# Altium schematic sheet Power.SchDoc
size A4; SheetNumber: 4; SheetTotal: 4
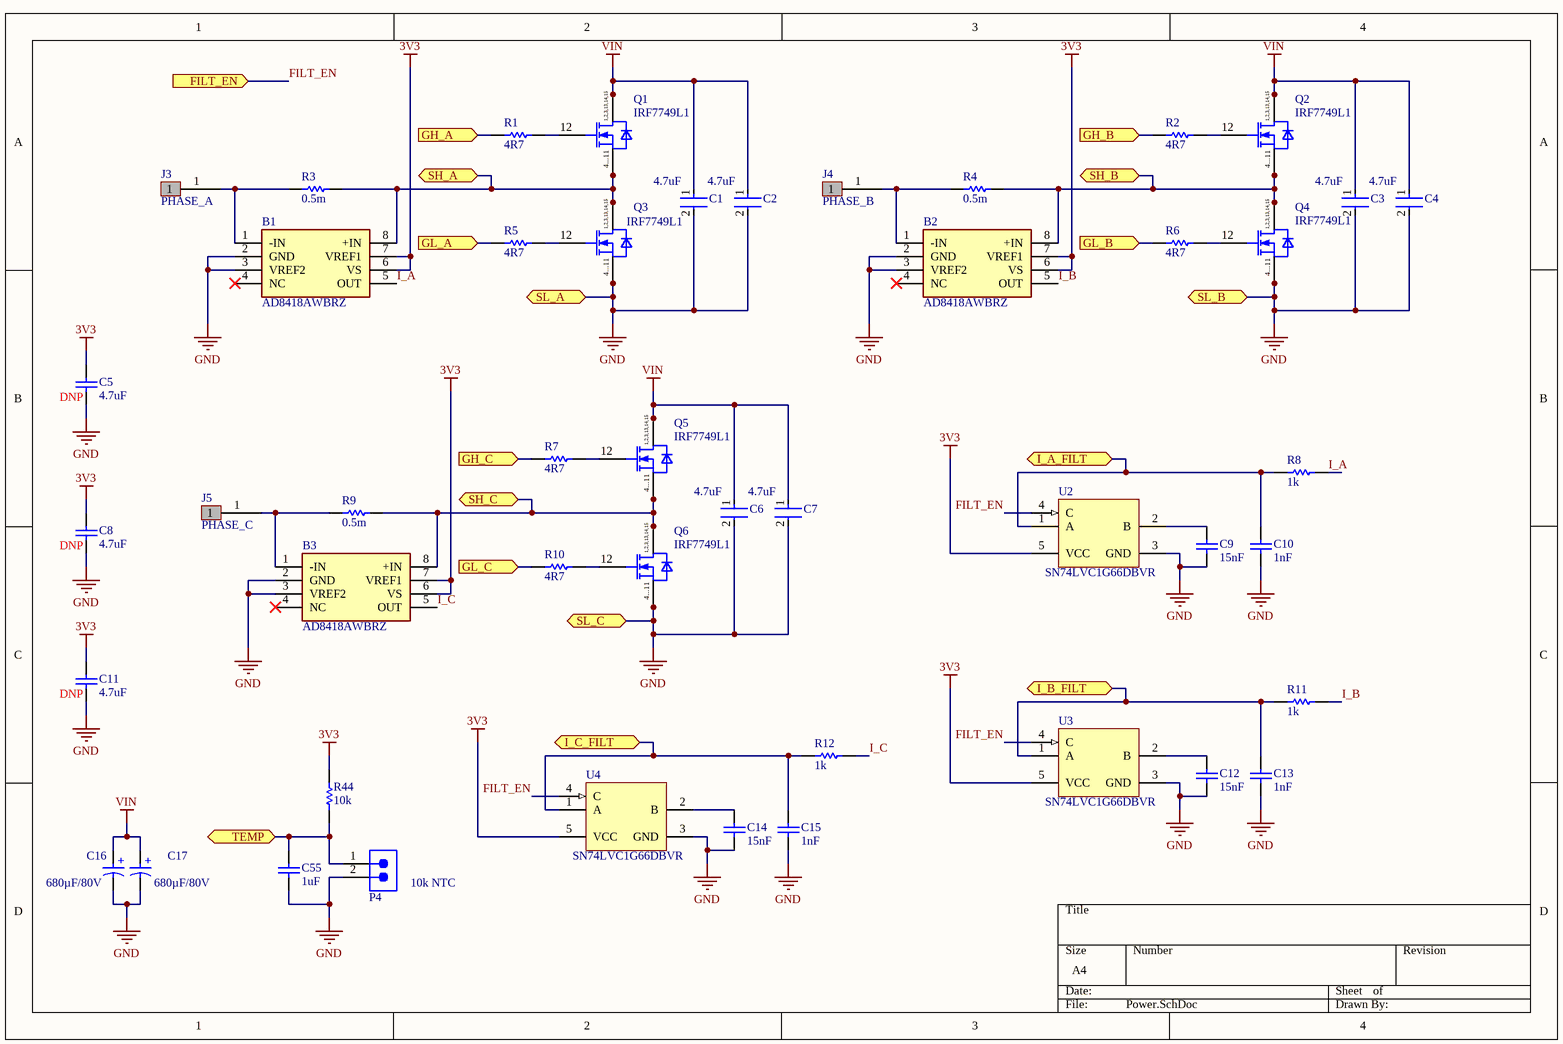
[diagram p0: Power.SchDoc]

## Parts
B1  AD8418AWBRZ  [SOP65P490X110-8N]
B2  AD8418AWBRZ  [SOP65P490X110-8N]
B3  AD8418AWBRZ  [SOP65P490X110-8N]
C1  Capacitance: 4.7uF  [FP-1210-L_3_2_0_3-W_2_5_0-IPC_A]  (hidden comment: HMK325C7475KN-TE)
C2  Capacitance: 4.7uF  [FP-1210-L_3_2_0_3-W_2_5_0-IPC_A]  (hidden comment: HMK325C7475KN-TE)
C3  Capacitance: 4.7uF  [FP-1210-L_3_2_0_3-W_2_5_0-IPC_A]  (hidden comment: HMK325C7475KN-TE)
C4  Capacitance: 4.7uF  [FP-1210-L_3_2_0_3-W_2_5_0-IPC_A]  (hidden comment: HMK325C7475KN-TE)
C5  value 4.7uF  [Wurth 0603 capacitor]  (hidden comment: Generic Capacitor 4.7uF 0603)
C6  Capacitance: 4.7uF  [FP-1210-L_3_2_0_3-W_2_5_0-IPC_A]  (hidden comment: HMK325C7475KN-TE)
C7  Capacitance: 4.7uF  [FP-1210-L_3_2_0_3-W_2_5_0-IPC_A]  (hidden comment: HMK325C7475KN-TE)
C8  value 4.7uF  [Wurth 0603 capacitor]  (hidden comment: Generic Capacitor 4.7uF 0603)
C9  value 15nF  [Wurth 0603 capacitor]  (hidden comment: Generic Capacitor 15nF 0603)
C10  value 1nF  [Wurth 0603 capacitor]  (hidden comment: Generic Capacitor 1nF 0603)
C11  value 4.7uF  [Wurth 0603 capacitor]  (hidden comment: Generic Capacitor 4.7uF 0603)
C12  value 15nF  [Wurth 0603 capacitor]  (hidden comment: Generic Capacitor 15nF 0603)
C13  value 1nF  [Wurth 0603 capacitor]  (hidden comment: Generic Capacitor 1nF 0603)
C14  value 15nF  [Wurth 0603 capacitor]  (hidden comment: Generic Capacitor 15nF 0603)
C15  value 1nF  [Wurth 0603 capacitor]  (hidden comment: Generic Capacitor 1nF 0603)
C16  value 680µF/80V  [WURTH THT CAP D18H25 - sideways]  (hidden comment: NCC EKY-800ELL681MM25S)
C17  value 680µF/80V  [WURTH THT CAP D18H25 - sideways]  (hidden comment: NCC EKY-800ELL681MM25S)
C55  value 1uF  [Wurth 0603 capacitor]  (hidden comment: Generic Capacitor 1uF 0603)
J3  PHASE_A  [Solder Pad 3X4MM]
J4  PHASE_B  [Solder Pad 3X4MM]
J5  PHASE_C  [Solder Pad 3X4MM]
P4  61300211121  [2x1 2.54mm F]  (value not drawn)
Q1  IRF7749L1  [INFINEON DIRECTFET-L8-V]
Q2  IRF7749L1  [INFINEON DIRECTFET-L8-V]
Q3  IRF7749L1  [INFINEON DIRECTFET-L8-V]
Q4  IRF7749L1  [INFINEON DIRECTFET-L8-V]
Q5  IRF7749L1  [INFINEON DIRECTFET-L8-V]
Q6  IRF7749L1  [INFINEON DIRECTFET-L8-V]
R1  value 4R7  [Wurth 0603 Resistor]  (hidden comment: Generic Resistor 4k7 0603)
R2  value 4R7  [Wurth 0603 Resistor]  (hidden comment: Generic Resistor 4k7 0603)
R3  value 0.5m  [WURTH 2512 RESISTOR]  (hidden comment: Yezhan ASR-M-3-0.5F)
R4  value 0.5m  [WURTH 2512 RESISTOR]  (hidden comment: Yezhan ASR-M-3-0.5F)
R5  value 4R7  [Wurth 0603 Resistor]  (hidden comment: Generic Resistor 4k7 0603)
R6  value 4R7  [Wurth 0603 Resistor]  (hidden comment: Generic Resistor 4k7 0603)
R7  value 4R7  [Wurth 0603 Resistor]  (hidden comment: Generic Resistor 4k7 0603)
R8  value 1k  [Wurth 0603 Resistor]  (hidden comment: Generic Resistor 1k 0603)
R9  value 0.5m  [WURTH 2512 RESISTOR]  (hidden comment: Yezhan ASR-M-3-0.5F)
R10  value 4R7  [Wurth 0603 Resistor]  (hidden comment: Generic Resistor 4k7 0603)
R11  value 1k  [Wurth 0603 Resistor]  (hidden comment: Generic Resistor 1k 0603)
R12  value 1k  [Wurth 0603 Resistor]  (hidden comment: Generic Resistor 1k 0603)
R44  value 10k  [Wurth 0603 Resistor]  (hidden comment: Generic Resistor 10k 0603)
U2  SN74LVC1G66DBVR  [DBV0005A_L]
U3  SN74LVC1G66DBVR  [DBV0005A_L]
U4  SN74LVC1G66DBVR  [DBV0005A_L]

## Ports
FILT_EN (in), GH_A (in), GH_B (in), GH_C (in), GL_A (in), GL_B (in), GL_C (in), I_A_FILT (bidir), I_B_FILT (bidir), I_C_FILT (bidir), SH_A (bidir), SH_B (bidir), SH_C (bidir), SL_A (bidir), SL_B (bidir), SL_C (bidir), TEMP (bidir)

## Nets
3V3: B1.6(VS) B1.7(VREF1) B2.6(VS) B2.7(VREF1) B3.6(VS) B3.7(VREF1) C5.2 C8.2 C11.2 R44.2 U2.5(VCC) U3.5(VCC) U4.5(VCC)
GND: B1.2(GND) B1.3(VREF2) B2.2(GND) B2.3(VREF2) B3.2(GND) B3.3(VREF2) C1.2 C2.2 C3.2 C4.2 C5.1 C6.2 C7.2 C8.1 C9.1 C10.1 C11.1 C12.1 C13.1 C14.1 C15.1 C16.2(N) C17.2(N) C55.1 P4.2 Q3.4(SOURCE1) Q3.5(SOURCE2) Q3.6(SOURCE3) Q3.7(SOURCE4) Q3.8(SOURCE5) Q3.9(SOURCE6) Q3.10(SOURCE7) Q3.11(SOURCE8) Q4.4(SOURCE1) Q4.5(SOURCE2) Q4.6(SOURCE3) Q4.7(SOURCE4) Q4.8(SOURCE5) Q4.9(SOURCE6) Q4.10(SOURCE7) Q4.11(SOURCE8) Q6.4(SOURCE1) Q6.5(SOURCE2) Q6.6(SOURCE3) Q6.7(SOURCE4) Q6.8(SOURCE5) Q6.9(SOURCE6) Q6.10(SOURCE7) Q6.11(SOURCE8) U2.3(GND) U3.3(GND) U4.3(GND) ; port SL_A, port SL_B, port SL_C
VIN: C1.1 C2.1 C3.1 C4.1 C6.1 C7.1 C16.1(P) C17.1(P) Q1.1(DRAIN1) Q1.2(DRAIN2) Q1.3(DRAIN3) Q1.13(DRAIN4) Q1.14(DRAIN5) Q1.15(DRAIN6) Q2.1(DRAIN1) Q2.2(DRAIN2) Q2.3(DRAIN3) Q2.13(DRAIN4) Q2.14(DRAIN5) Q2.15(DRAIN6) Q5.1(DRAIN1) Q5.2(DRAIN2) Q5.3(DRAIN3) Q5.13(DRAIN4) Q5.14(DRAIN5) Q5.15(DRAIN6)
FILT_EN: U2.4(C) U3.4(C) U4.4(C) ; port FILT_EN
GH_A: R1.1 ; port GH_A
GH_B: R2.1 ; port GH_B
GH_C: R7.1 ; port GH_C
GL_A: R5.1 ; port GL_A
GL_B: R6.1 ; port GL_B
GL_C: R10.1 ; port GL_C
I_A: B1.5(OUT) R8.2
I_A_FILT: C10.2 R8.1 U2.1(A) ; port I_A_FILT
I_B: B2.5(OUT) R11.2
I_B_FILT: C13.2 R11.1 U3.1(A) ; port I_B_FILT
I_C: B3.5(OUT) R12.2
I_C_FILT: C15.2 R12.1 U4.1(A) ; port I_C_FILT
SH_A: B1.8(+IN) Q1.4(SOURCE1) Q1.5(SOURCE2) Q1.6(SOURCE3) Q1.7(SOURCE4) Q1.8(SOURCE5) Q1.9(SOURCE6) Q1.10(SOURCE7) Q1.11(SOURCE8) Q3.1(DRAIN1) Q3.2(DRAIN2) Q3.3(DRAIN3) Q3.13(DRAIN4) Q3.14(DRAIN5) Q3.15(DRAIN6) R3.2 ; port SH_A
SH_B: B2.8(+IN) Q2.4(SOURCE1) Q2.5(SOURCE2) Q2.6(SOURCE3) Q2.7(SOURCE4) Q2.8(SOURCE5) Q2.9(SOURCE6) Q2.10(SOURCE7) Q2.11(SOURCE8) Q4.1(DRAIN1) Q4.2(DRAIN2) Q4.3(DRAIN3) Q4.13(DRAIN4) Q4.14(DRAIN5) Q4.15(DRAIN6) R4.2 ; port SH_B
SH_C: B3.8(+IN) Q5.4(SOURCE1) Q5.5(SOURCE2) Q5.6(SOURCE3) Q5.7(SOURCE4) Q5.8(SOURCE5) Q5.9(SOURCE6) Q5.10(SOURCE7) Q5.11(SOURCE8) Q6.1(DRAIN1) Q6.2(DRAIN2) Q6.3(DRAIN3) Q6.13(DRAIN4) Q6.14(DRAIN5) Q6.15(DRAIN6) R9.2 ; port SH_C
TEMP: C55.2 P4.1 R44.1 ; port TEMP
NetB1_1: B1.1(-IN) J3.1 R3.1
NetB2_1: B2.1(-IN) J4.1 R4.1
NetB3_1: B3.1(-IN) J5.1 R9.1
NetC9_2: C9.2 U2.2(B)
NetC12_2: C12.2 U3.2(B)
NetC14_2: C14.2 U4.2(B)
NetQ1_12: Q1.12(GATE) R1.2
NetQ2_12: Q2.12(GATE) R2.2
NetQ3_12: Q3.12(GATE) R5.2
NetQ4_12: Q4.12(GATE) R6.2
NetQ5_12: Q5.12(GATE) R7.2
NetQ6_12: Q6.12(GATE) R10.2

Not connected (* = marked no-connect by the designer): B1 4(NC)*; B2 4(NC)*; B3 4(NC)*

## Notes on the sheet
- (near C5) DNP
- (near C8) DNP
- (near C11) DNP
- (near P4) 10k NTC
- (in symbol IRF7749L1) 1,2,3,13,14,15; 4...11
- (in symbol NCC 680uF/80V TH) +

## Library data of the parts
B1-B3 = AD8418AWBRZ: Bidir.Zero-Drift Current Sense Amp SOIC8 Analog Devices AD8418AWBRZ, Current Sensing Amplifier Single Buffered 8-Pin SOIC; Geometry.Height: 1.1mm; Manufacturer_Name: Analog Devices; Manufacturer_Part_Number: AD8418AWBRZ; Mouser Part Number: 584-AD8418AWBRZ; Mouser Price/Stock: https://www.mouser.co.uk/ProductDetail/Analog-Devices/AD8418AWBRZ?qs=%2F9jDaHz9Z2grAr7OTzLKmg%3D%3D; Arrow Part Number: AD8418AWBRZ; Arrow Price/Stock: https://www.arrow.com/en/products/ad8418awbrz/analog-devices?utm_currency=USD&region=nac; Datasheet Link: http://www.analog.com/media/en/technical-documentation/data-sheets/AD8418A.pdf
C1-C4 C6 C7 = CMP-14477-000323-2: None; Tolerance: 10%; Voltage Rating: 100V; Max Operating Temperature: 125°C; Min Operating Temperature: -55°C; Packaging: Tape and Reel; Mount: Surface Mount; RoHS Compliant: Yes; Case Code (Metric): 3225; Case Code (Imperial): 1210; Case/Package: 1210
C16 C17 = NCC 680uF/80V TH: Bulk/Capacitor, Aluminum, 80 V, Cap.680 , Dia.18 , Leng.25 |Chemi-Con EKY-800ELL681MM25S; Manufacturer: United Chemi-Con; Dielectric Material: Aluminium; Dissipation Factor: 9%; Impedance: 36mΩ; Lead/Base Style: Straight; Leakage Current: 544µA; Life (Hours): 10000hours; Polarity: Polar; Ripple Current: 1.75A; Test Frequency: 100MHz; Tolerance: 20%; Voltage: 80V; Supplier: DigiKey; Supplier Part Number: 565-EKY-800ELL681MM25S-ND; Manufacturer Part Number: EKY-800ELL681MM25S; RoHS: Compliant; Category: Aluminum Electrolytic Capacitors; Stock: 70; Pricing: 1=2,66, 10=1,772, 50=1,4002, 100=1,283, 500=1,08148, 1000=1,01807, 2500=0,95043, 5000=0,90925 (USD); Case/Package: Radial; China RoHS: Compliant; Contact Plating: Tin; Diameter: 18mm; Height: 25mm; Height - Seated (Max): 26.4922mm; Lead Free: Lead Free; Lead Pitch: 7.493mm; Length: 25mm; Lifecycle Status: Production; Max Operating Temperature: 105°C; Min Operating Temperature: -40°C; Mounting Technology: Through Hole; Pins: 2; Number of Terminals: 2; Packaging: Bulk; Radiation Hardening: No; REACH SVHC: No; Schedule B: 853222***; Terminal Pitch: 7.5mm; Termination: Radial; Voltage Rating: 80V; Voltage Rating (DC): 80V; ComponentLink1URL: https://datasheet.octopart.com:443/EKY-800ELL681MM25S-Nippon-Chemicon-datasheet-182100250.pdf?src-supplier=IHS; ComponentLink1Description: https://datasheet.octopart.com:443/EKY-800ELL681MM25S-Nippon-Chemicon-datasheet-182100250.pdf?src-supplier=IHS; ComponentLink2URL: https://datasheet.octopart.com:443/EKY-800ELL681MM25S-United-Chemi-Con-datasheet-33024962.pdf?src-supplier=IHS; ComponentLink2Description: https://datasheet.octopart.com:443/EKY-800ELL681MM25S-United-Chemi-Con-datasheet-33024962.pdf?src-supplier=IHS; ComponentLink3URL: https://datasheet.octopart.com:443/EKY-800ELL681MM25S-United-Chemi-Con-datasheet-153683879.pdf?src-supplier=United+Chemi-Con; ComponentLink3Description: https://datasheet.octopart.com:443/EKY-800ELL681MM25S-United-Chemi-Con-datasheet-153683879.pdf?src-supplier=United+Chemi-Con; ComponentLink4URL: https://datasheet.octopart.com:443/EKY-800ELL681MM25S-United-Chemi-Con-datasheet-154730619.pdf?src-supplier=Electro+Sonic; ComponentLink4Description: https://datasheet.octopart.com:443/EKY-800ELL681MM25S-United-Chemi-Con-datasheet-154730619.pdf?src-supplier=Electro+Sonic
J3-J5 = Solder pad
P4 = 2P: WR-PHD Pin Header, THT, Vertical, pitch 2.54mm, 1 Row, 2P; Manufacturer: Wurth Elektronik; Contact Resistance: 20mOhm; Rated Current: 3A; Working Voltage: 250V; Withstanding Voltage: 500V; Manufacturer Part Number: 61300211121; Category: Board-to-Board Connectors; Match Code: WR-PHD; ComponentLink1Description: Website Link; ComponentLink1URL: https://www.we-online.com/redexpert/article/61300211121?ad; ComponentLink2Description: Datasheet Link; ComponentLink2URL: https://www.we-online.com/redexpert/spec/61300211121?ad; Mount: Through Hole; Operating Temperature Max: 105°C; Operating Temperature Min: -40°C; Packaging: Bag; Gender: Pin Header; Number of Pins: 2; Number of Rows: 1; Orientation: Vertical; Pitch: 2.54mm
Q1-Q6 = IRF7749L1: Insulated-Gate Field-Effect Transistor (IGFET), N-Channel, Enhancement, Body Diode, Pin 1 Drain, 2 Drain, 3 Drain , 4 Source, 5 Source, 6 Source, 7 Source, 8 Source, 9 Source, 10 Source, 11 Source, 12 Gate, 13 Drain, 14 Drain, 15 Drain, 15 Pins; Manufacturer: Infineon Technologies; PackageReference: DirectFET L8; Manufacturer Order Number: IRF7749L1
R1 R2 R5-R7 R10 = Generic Resistor 4R7 0603
R3 R4 R9 = Yezhan ASR-M-3-0.5F: 6W 0.5mΩ Patch Splitter ±115ppm/℃ ±1% 2512 Current Sense Resistors / Shunt Resistors ROHS
U2-U4 = CMP-0859-00173-3: Single Analog Switch, DBV0005A, LARGE T&R; Manufacturer: Texas Instruments; Output Drive (IOL/IOH)(Max)(mA): 32/-32; ICC @ Nom Voltage(Max)(mA): 0.01; VCC(Min)(V): 1.65; Rating: Catalog; Bits(#): 1; tpd @ Nom Voltage(Max)(ns): 2,1.2,0.8,0.6; Logic: True; Output Type: CMOS; Schmitt Trigger: No; Switch Configuration: SPST; Input Type: CMOS/TTL; F @ Nom Voltage(Max)(Mhz): 150; VCC(Max)(V): 5.5; Technology Family: LVC; Voltage(Nom)(V): 1.8,2.5,3.3,5; Operating Temperature Range(C): -40 to 85; Generic Part Number: SN74LVC1G66; DatasheetVersion: SCES323O; PackageReference: DBV0005A; Channels(#): 1; 3-State Output: No